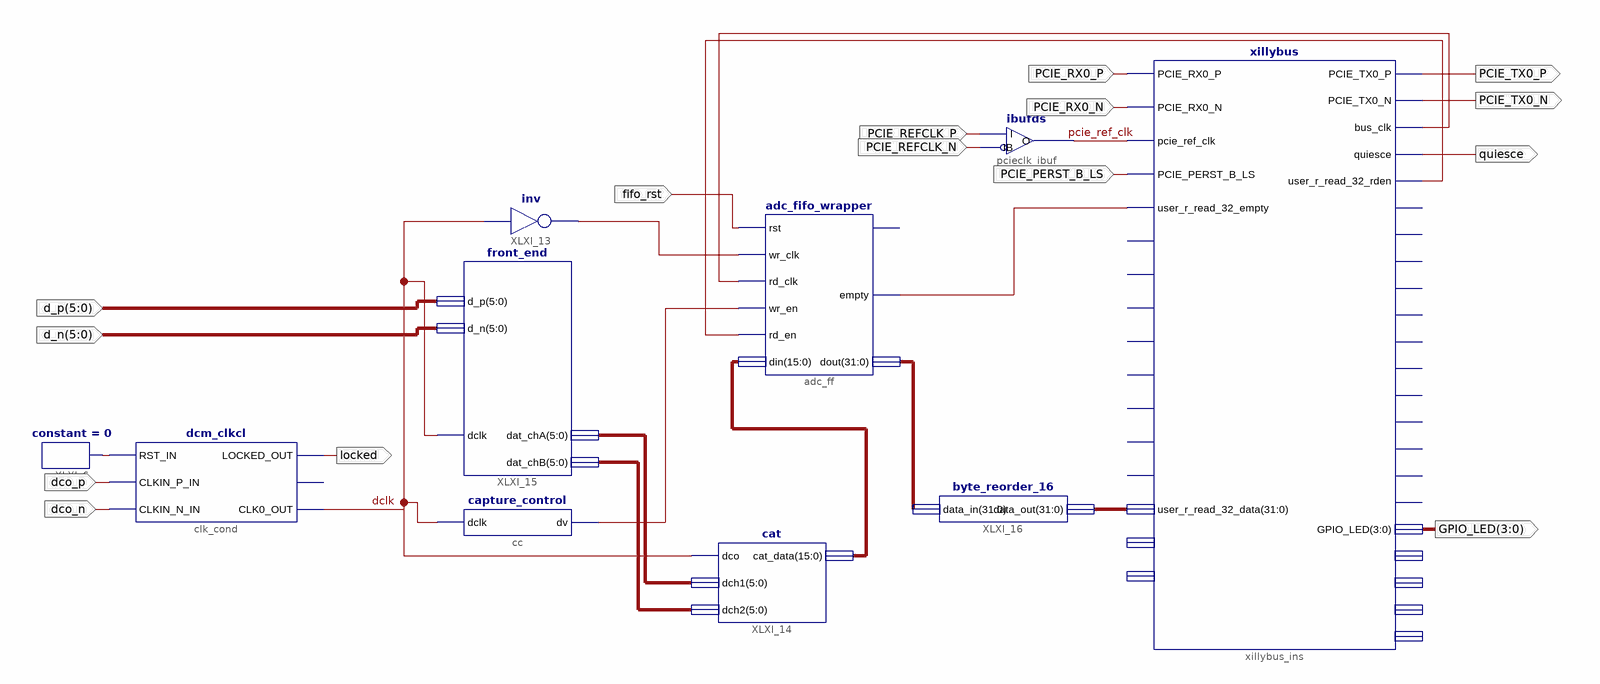
[diagram p0: schematic sheet 1]
// Xilinx ISE schematic top.sch (virtex5) as structural Verilog: 10 symbols, 15 ports
module top (
  input  dco_p,
  input  dco_n,
  input  [5:0] d_p,
  input  [5:0] d_n,
  input  PCIE_REFCLK_P,
  input  PCIE_REFCLK_N,
  input  PCIE_RX0_P,
  input  PCIE_RX0_N,
  input  PCIE_PERST_B_LS,
  input  fifo_rst,
  output locked,
  output [3:0] GPIO_LED,
  output PCIE_TX0_P,
  output PCIE_TX0_N,
  output quiesce
);

  wire dclk, pcie_ref_clk, XLXN_8, XLXN_22, XLXN_23, XLXN_27, XLXN_29, XLXN_41;
  wire [5:0] XLXN_49, XLXN_50;
  wire [15:0] XLXN_44;
  wire [31:0] XLXN_51, XLXN_52;

  dcm_clkcl clk_cond (
    .RST_IN(XLXN_8), .CLKIN_P_IN(dco_p), .CLKIN_N_IN(dco_n), .LOCKED_OUT(locked), .CLK0_OUT(dclk));  // open: CLKIN_IBUFGDS_OUT
  xillybus xillybus_ins (
    .PCIE_RX0_P(PCIE_RX0_P), .PCIE_RX0_N(PCIE_RX0_N), .pcie_ref_clk(pcie_ref_clk),
    .PCIE_PERST_B_LS(PCIE_PERST_B_LS), .user_r_read_32_empty(XLXN_29), .user_r_read_32_data(XLXN_52),
    .PCIE_TX0_P(PCIE_TX0_P), .PCIE_TX0_N(PCIE_TX0_N), .bus_clk(XLXN_22), .quiesce(quiesce),
    .user_r_read_32_rden(XLXN_23), .GPIO_LED(GPIO_LED));  // open: user_r_read_32_eof, user_w_write_32_full, user_r_read_8_empty, user_r_read_8_eof, user_w_write_8_full, user_r_mem_8_empty, user_r_mem_8_eof, user_w_mem_8_full, user_r_read_8_data, user_r_mem_8_data, user_r_read_32_open, user_w_write_32_wren, user_w_write_32_open, user_r_read_8_rden, user_r_read_8_open, user_w_write_8_wren, user_w_write_8_open, user_r_mem_8_rden, user_r_mem_8_open, user_w_mem_8_wren, user_w_mem_8_open, user_mem_8_addr_update, user_w_write_32_data, user_w_write_8_data, user_w_mem_8_data, user_mem_8_addr
  constant #(.CValue("0")) XLXI_6 (.O(XLXN_8));
  ibufds pcieclk_ibuf (.I(PCIE_REFCLK_P), .IB(PCIE_REFCLK_N), .O(pcie_ref_clk));
  adc_fifo_wrapper adc_ff (
    .rst(fifo_rst), .wr_clk(XLXN_27), .rd_clk(XLXN_22), .wr_en(XLXN_41), .rd_en(XLXN_23), .din(XLXN_44),
    .empty(XLXN_29), .dout(XLXN_51));  // open: full
  capture_control cc (.dclk(dclk), .dv(XLXN_41));
  not XLXI_13 (XLXN_27, dclk);
  cat XLXI_14 (.dco(dclk), .dch1(XLXN_49), .dch2(XLXN_50), .cat_data(XLXN_44));
  front_end XLXI_15 (.d_p(d_p), .d_n(d_n), .dclk(dclk), .dat_chA(XLXN_49), .dat_chB(XLXN_50));
  byte_reorder_16 XLXI_16 (.data_in(XLXN_51), .data_out(XLXN_52));
endmodule
